# Altium schematic sheet Sheet1.SCHDOC
size 840 x 594 mm; SheetNumber: 1; SheetTotal: 5; DocumentName: Sheet1.SCHDOC
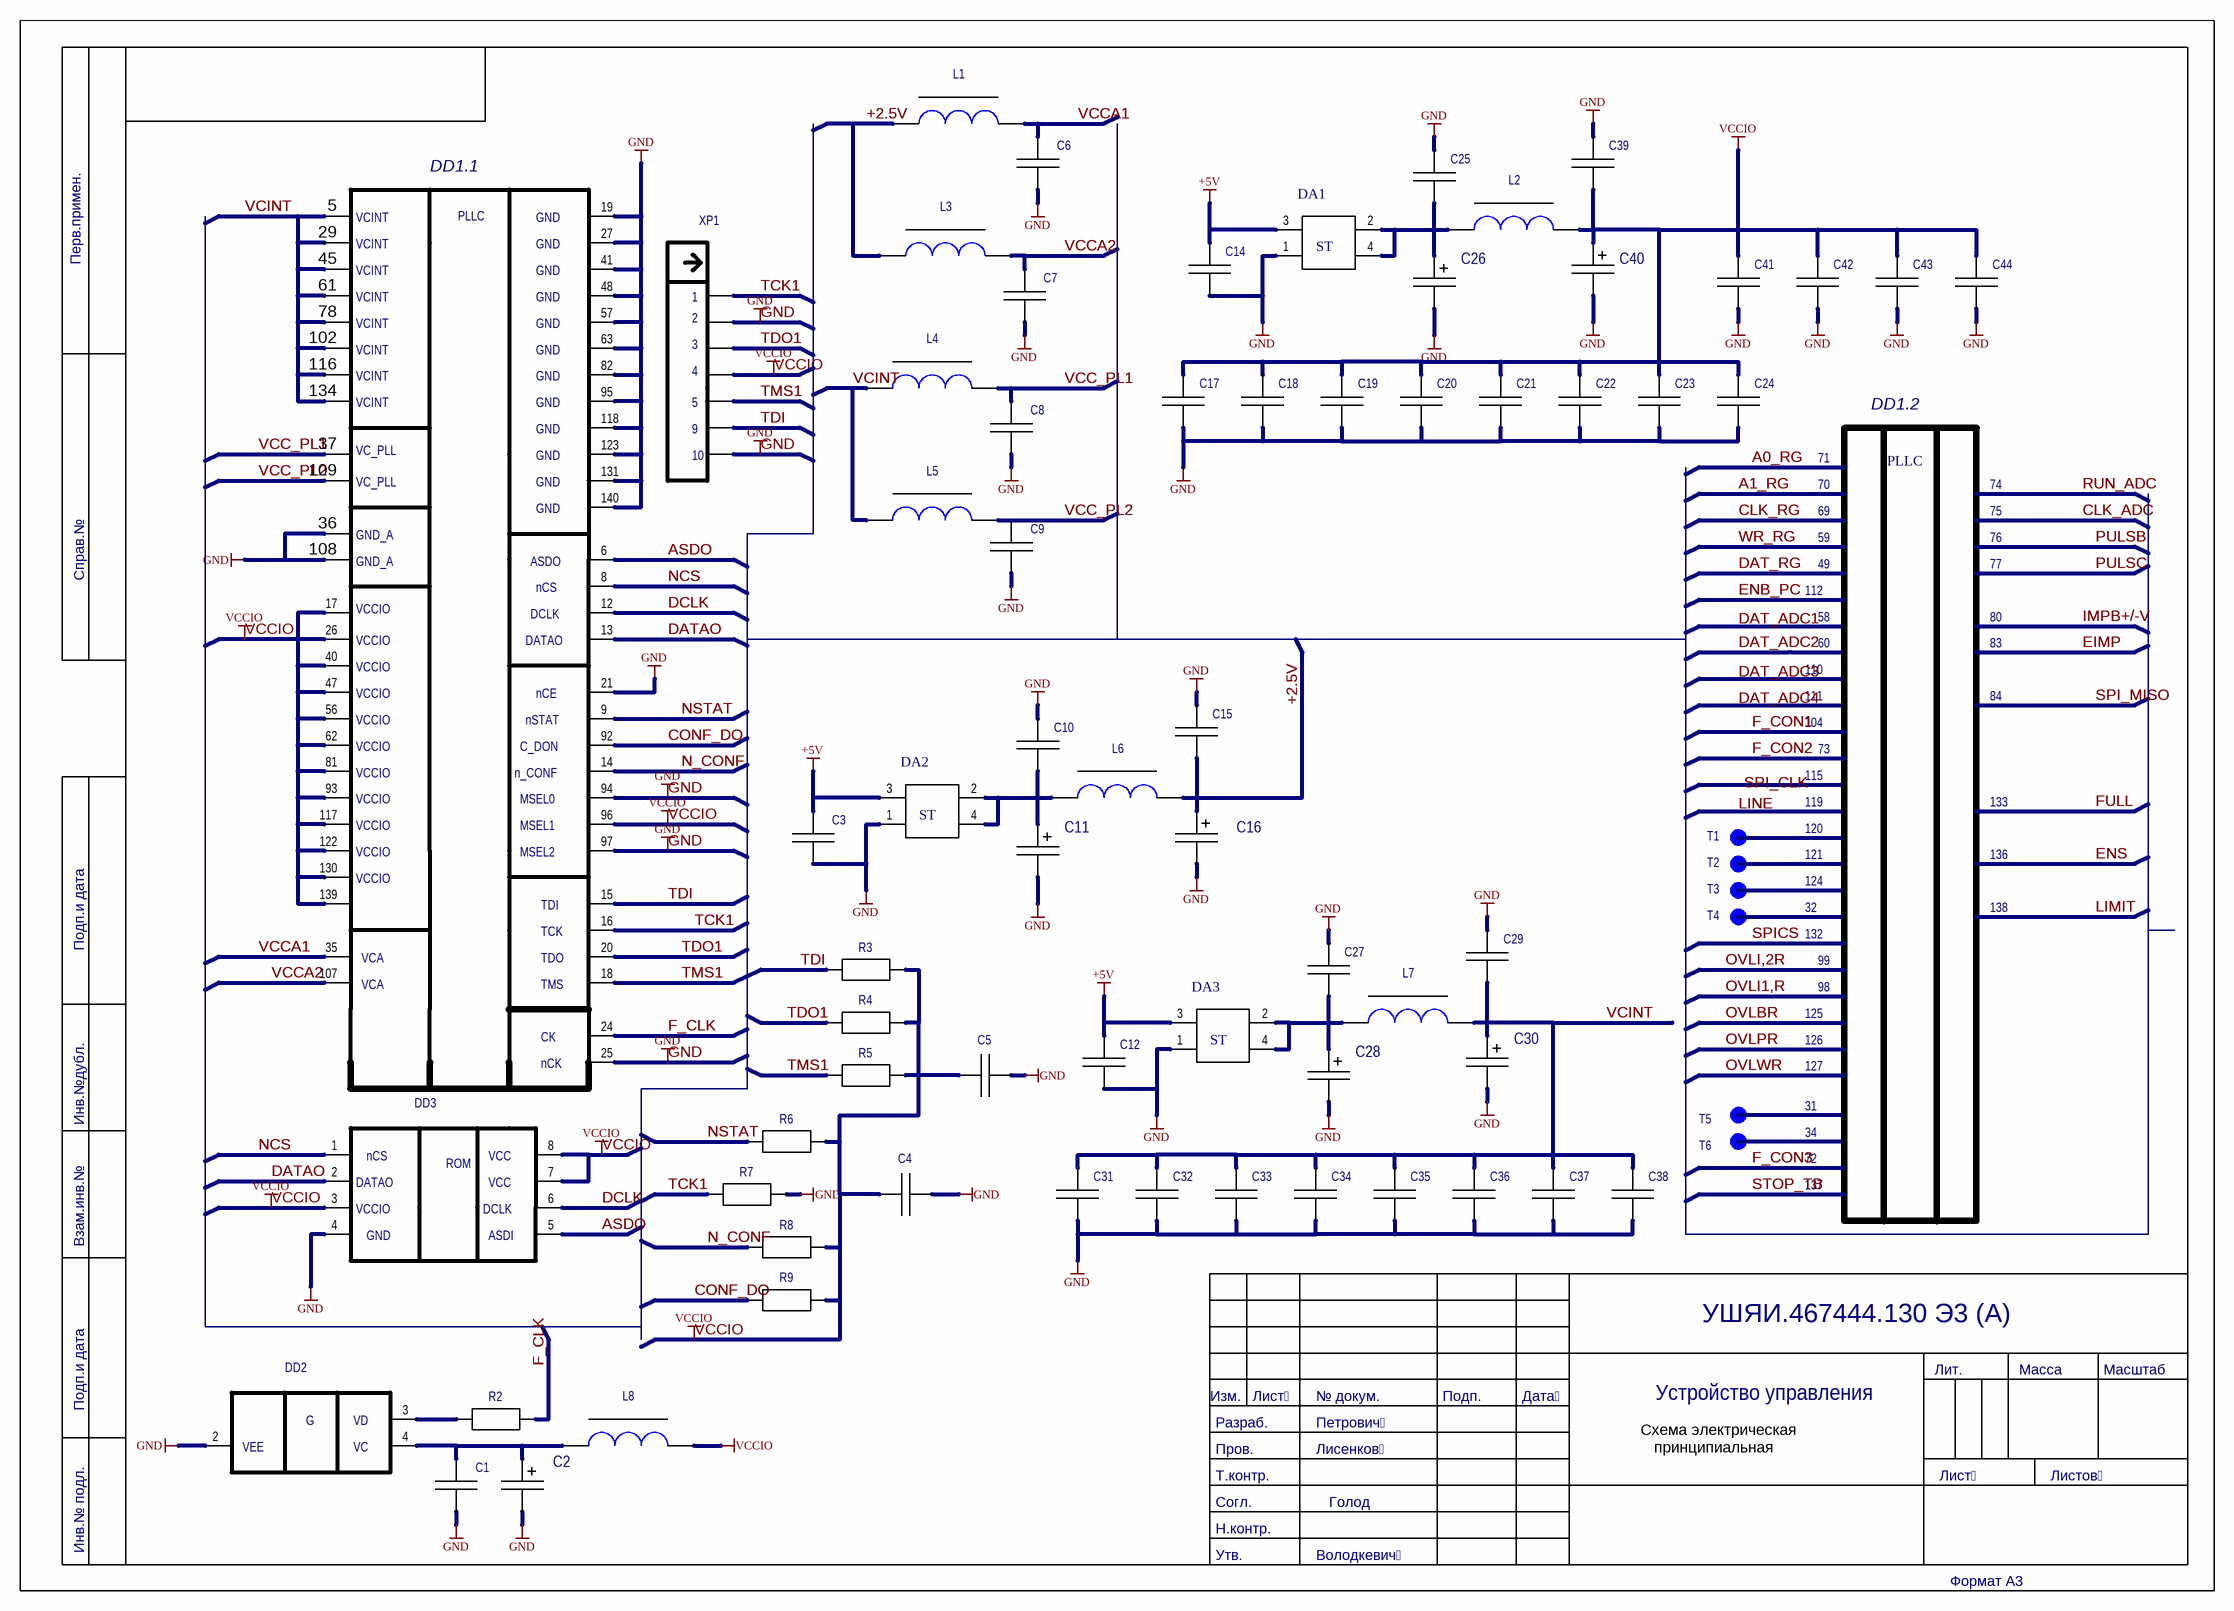
[diagram p0: Sheet1.SCHDOC]

## Parts
C1  GRM21BR71H104KA01L  (value not drawn)
C2  TAJB475K020  (value not drawn)
C3  GRM21BR71H104KA01L  (value not drawn)
C4  GRM21BR71H104KA01L  (value not drawn)
C5  GRM21BR71H104KA01L  (value not drawn)
C6  GRM21BR71H104KA01L  (value not drawn)
C7  GRM21BR71H104KA01L  (value not drawn)
C8  GRM21BR71H104KA01L  (value not drawn)
C9  GRM21BR71H104KA01L  (value not drawn)
C10  GRM21BR71H104KA01L  (value not drawn)
C11  TAJB475K020  (value not drawn)
C12  GRM21BR71H104KA01L  (value not drawn)
C14  GRM21BR71H104KA01L  (value not drawn)
C15  GRM21BR71H104KA01L  (value not drawn)
C16  TAJB106M016  (value not drawn)
C17  GRM21BR71H104KA01L  (value not drawn)
C18  GRM21BR71H104KA01L  (value not drawn)
C19  GRM21BR71H104KA01L  (value not drawn)
C20  GRM21BR71H104KA01L  (value not drawn)
C21  GRM21BR71H104KA01L  (value not drawn)
C22  GRM21BR71H104KA01L  (value not drawn)
C23  GRM21BR71H104KA01L  (value not drawn)
C24  GRM21BR71H104KA01L  (value not drawn)
C25  GRM21BR71H104KA01L  (value not drawn)
C26  TAJB475K020  (value not drawn)
C27  GRM21BR71H104KA01L  (value not drawn)
C28  TAJB475K020  (value not drawn)
C29  GRM21BR71H104KA01L  (value not drawn)
C30  TAJB106M016  (value not drawn)
C31  GRM21BR71H104KA01L  (value not drawn)
C32  GRM21BR71H104KA01L  (value not drawn)
C33  GRM21BR71H104KA01L  (value not drawn)
C34  GRM21BR71H104KA01L  (value not drawn)
C35  GRM21BR71H104KA01L  (value not drawn)
C36  GRM21BR71H104KA01L  (value not drawn)
C37  GRM21BR71H104KA01L  (value not drawn)
C38  GRM21BR71H104KA01L  (value not drawn)
C39  GRM21BR71H104KA01L  (value not drawn)
C40  TAJB106M016  (value not drawn)
C41  GRM21BR71H104KA01L  (value not drawn)
C42  GRM21BR71H104KA01L  (value not drawn)
C43  GRM21BR71H104KA01L  (value not drawn)
C44  GRM21BR71H104KA01L  (value not drawn)
DA1  LD1117AS33TR  (value not drawn)
DA2  LD1117AS25TR  (value not drawn)
DA3  LD1117AS12TR  (value not drawn)
DD1.1  EP3C5E144I7-G  (value not drawn)
DD2  J032  (value not drawn)
DD3  EPCS4SI8N  (value not drawn)
L1  LQH31CNR22M03  (value not drawn)
L2  ILBB0805ER601V  (value not drawn)
L3  LQH31CNR22M03  (value not drawn)
L4  LQH31CNR22M03  (value not drawn)
L5  LQH31CNR22M03  (value not drawn)
L6  ILBB0805ER601V  (value not drawn)
L7  ILBB0805ER601V  (value not drawn)
L8  ILBB0805ER601V  (value not drawn)
R2  0805-51 ОМ+-5%  [0805]  (value not drawn)
R3  0805-1 KОМ+-5%  [0805]  (value not drawn)
R4  0805-10 KОМ+-5%  [0805]  (value not drawn)
R5  0805-1 KОМ+-5%  [0805]  (value not drawn)
R6  0805-10 KОМ+-5%  [0805]  (value not drawn)
R7  0805-1 KОМ+-5%  [0805]  (value not drawn)
R8  0805-10 KОМ+-5%  [0805]  (value not drawn)
R9  0805-10 KОМ+-5%  [0805]  (value not drawn)
T1  ТОЧКА ПАЙКИ 1  [LEPESTOK7_750_224]  (value not drawn)
T13  ТОЧКА ПАЙКИ 1  [LEPESTOK7_750_224]  (value not drawn)
T14  ТОЧКА ПАЙКИ 1  [LEPESTOK7_750_224]  (value not drawn)
T15  ТОЧКА ПАЙКИ 1  [LEPESTOK7_750_224]  (value not drawn)
T20  ТОЧКА ПАЙКИ 1  [LEPESTOK7_750_224]  (value not drawn)
T21  ТОЧКА ПАЙКИ 1  [LEPESTOK7_750_224]  (value not drawn)
XP1  PLD-10  (value not drawn)

## Nets
+5V: C3.2 C12.2 C14.2 DA1.3 DA2.3 DA3.3
GND: C1.1 C2.2 C3.1 C4.2 C5.2 C6.1 C7.1 C8.1 C9.1 C10.2 C11.2 C12.1 C14.1 C15.2 C16.2 C17.1 C18.1 C19.1 C20.1 C21.1 C22.1 C23.1 C24.1 C25.2 C26.2 C27.2 C28.2 C29.2 C30.2 C31.1 C32.1 C33.1 C34.1 C35.1 C36.1 C37.1 C38.1 C39.2 C40.2 C41.1 C42.1 C43.1 C44.1 DA1.1 DA2.1 DA3.1 DD1.1.19 DD1.1.21 DD1.1.25 DD1.1.27 DD1.1.36 DD1.1.41 DD1.1.48 DD1.1.57 DD1.1.63 DD1.1.82 DD1.1.94 DD1.1.95 DD1.1.97 DD1.1.108 DD1.1.118 DD1.1.123 DD1.1.131 DD1.1.140 DD2.2 DD3.4 R7.2 XP1.2 XP1.10
VCCIO: C4.1 C5.1 C17.2 C18.2 C19.2 C20.2 C21.2 C22.2 C23.2 C24.2 C39.1 C40.1 C41.2 C42.2 C43.2 C44.2 DD1.1.17 DD1.1.26 DD1.1.40 DD1.1.47 DD1.1.56 DD1.1.62 DD1.1.81 DD1.1.93 DD1.1.96 DD1.1.117 DD1.1.122 DD1.1.130 DD1.1.139 DD3.3 DD3.7 DD3.8 L2.2 L8.2 R3.2 R4.2 R5.2 R6.2 R8.2 R9.2 XP1.4
+2.5V: C15.1 C16.1 L1.1 L3.1 L6.2
ASDO: DD1.1.6 DD3.5
CONF_DO: DD1.1.92 R9.1
DATAO: DD1.1.13 DD3.2
DCLK: DD1.1.12 DD3.6
F_CLK: DD1.1.24 R2.2
N_CONF: DD1.1.14 R8.1
NCS: DD1.1.8 DD3.1
NSTAT: DD1.1.9 R6.1
TCK1: DD1.1.16 R7.1 XP1.1
TDI: DD1.1.15 R3.1 XP1.9
TDO1: DD1.1.20 R4.1 XP1.3
TMS1: DD1.1.18 R5.1 XP1.5
VCC_PL1: C8.2 DD1.1.37 L4.2
VCC_PL2: C9.2 DD1.1.109 L5.2
VCCA1: C6.2 DD1.1.35 L1.2
VCCA2: C7.2 DD1.1.107 L3.2
VCINT: C29.1 C30.1 C31.2 C32.2 C33.2 C34.2 C35.2 C36.2 C37.2 C38.2 DD1.1.5 DD1.1.29 DD1.1.45 DD1.1.61 DD1.1.78 DD1.1.102 DD1.1.116 DD1.1.134 L4.1 L5.1 L7.2
NetC1_2: C1.2 C2.1 DD2.4 L8.1
NetC10_1: C10.1 C11.1
NetC25_1: C25.1 C26.1 DA1.2 DA1.4 L2.1
NetC27_1: C27.1 C28.1
NetDA2_2: DA2.2 DA2.4 L6.1
NetDA3_2: DA3.2 DA3.4 L7.1
NetDD2_3: DD2.3 R2.1

Not connected (* = marked no-connect by the designer): T1 1; T13 1; T14 1; T15 1; T20 1; T21 1

## Notes on the sheet
- (near DD1.1) DD1.1
- Перв.примен.
- DD1.2
- 70
- 71
- PLLC
- 74
- 69
- 49
- 59
- 75
- 76
- 77
- Справ.№
- 112
- 58
- 80
- 110
- 111
- 60
- 84
- 83
- 104
- 73
- 120
- 115
- 119
- 133
- T1
- T2
- T3
- 121
- 124
- 136
- Подп.и дата
- T4
- 32
- 132
- 99
- 138
- 125
- 98
- 126
- 127
- Инв.№дубл.
- T5
- T6
- 72
- 34
- 31
- Взам.инв.№
- 137
- УШЯИ.467444.130 Э3 (A)
- Лит.
- Масса
- Масштаб
- Изм.
- Разраб.
- Лист
- № докум.
- Петрович
- Подп.
- Дата
- Устройство управления
- Т.контр.
- Согл.
- Пров.
- Лисенков
- Голод
- Схема электрическая
  принципиальная
- Листов
- Инв.№ подл.
- Утв.
- Н.контр.
- Володкевич
- Формат А3
- Подп. дата
- Инв. № дубл.
- Взам. инв. №
- Подп. и дата
- Инв. № подл.
- Лист
- Дата
- ALTIUM GOSTBOM2.0 KEV
- Файл:
- Копировал
- (in symbol EP3C5E144I7-G) PLLC; VCINT; GND; VC_PLL; GND_A; ASDO; nCS; VCCIO; DCLK; DATAO; nCE; nSTAT; C_DON; n_CONF; MSEL0; MSEL1; MSEL2; TDI; TCK; VCA; TDO; TMS; CK; nCK
- (in symbol EPCS4SI8N) ROM; nCS; VCC; DATAO; VCCIO; DCLK; GND; ASDI
- (in symbol J032) G; VD; VEE; VC
- (in symbol LD1117AS12TR) ST
- (in symbol LD1117AS25TR) ST
- (in symbol LD1117AS33TR) ST

## Library data of the parts
C1 C3-C10 C12 C14 C15 C17-C25 C27 C29 C31-C39 C41-C44 = GRM21BR71H104KA01L: Name2: Конденсатор GRM21BR71H104KA01L; Value: *; Name1: Конденсатор GRM21BR71H104KA01L
C2 C11 C26 C28 = TAJB475K020: Standart: AVX; Name2: Конденсатор  TAJB475K020; Name1: Конденсатор TAJB475K020; Value: *
C16 C30 C40 = TAJB106M016: Standart: AVX; Name2: Конденсатор  TAJB106M016; Name1: Конденсатор TAJB106M016; Value: *
L1 L3-L5 = LQH31CNR22M03: Standart: MURATA; Name2: Дроссель LQH31CNR22M03; Name1: Дроссель LQH31CNR22M03
L2 L6-L8 = ILBB0805ER601V: Standart: MURATA; Name2: Дроссель ILBB0805ER601V; Name1: Дроссель ILBB0805ER601V
R2 = 0805-51 ОМ+-5%: Value: 51 Ом; Name1: Резистор 0805-51 Ом +-5%; Name2: Резистор 0805-51 Ом +-5%
R3 R5 R7 = 0805-1 KОМ+-5%: Value: 1 кОм; Name1: Резистор 0805-1 кОм+-5%; Name2: Резистор 0805-1 кОм+-5%
R4 R6 R8 R9 = 0805-10 KОМ+-5%: Name1: Резистор 0805-10 кОм+-5%; Name2: Резистор 0805-10 кОм+-5%
T1 T13-T15 T20 T21 = ТОЧКА ПАЙКИ 1: Name: Точка пайки; Value: *
DA1 = LD1117AS33TR: Value: *
DA2 = LD1117AS25TR: Value: *
DA3 = LD1117AS12TR: Value: *
DD1.1 = EP3C5E144I7-G: Value: *
DD2 = J032: Value: *
DD3 = EPCS4SI8N: Value: *
XP1 = PLD-10: Value: *